# Altium schematic sheet can.SchDoc: {Наименование}
size 209 x 297 mm; DocumentNumber: {Обозначение}; SheetNumber: 3; SheetTotal: 4; PageSetup: Record=PageOptions|CenterHorizontal=False|CenterVertical=False|PrintScale=0.95|XCorrection=0.00|YCorrection=0.00|PrintKind=1|BorderSize=5000000|LeftOffset=0|BottomOffset=0|Orientation=1|PaperLength=1000|PaperWidth=1000|Scale=100|PaperSource=15|PrintQuality=600|MediaType=1|DitherType=10|PaperKind=A4|PrintScaleMode=1; Rule: PcbType=ProtelPcb
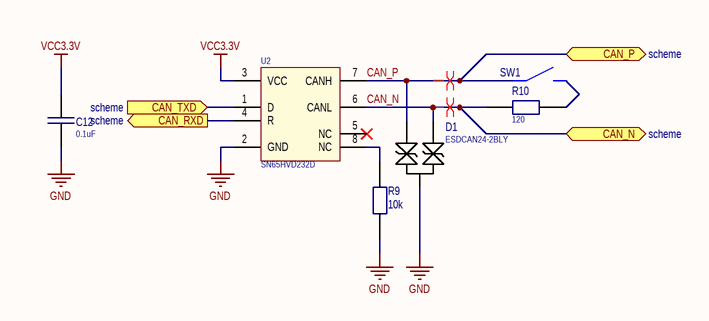
[diagram p0: can.SchDoc]

## Parts
C12  0.1uF  [C_0603]
D1  ESDCAN24-2BLY  [SOT23]
R9  10k  [R_0603]
R10  120  [R_0603]
SW1  DS1040-01RT  [DS1040-01RT]  (value not drawn)
U2  SN65HVD232D  [SO-8_M]

## Ports
CAN_N (bidir, see scheme), CAN_P (bidir, see scheme), CAN_RXD (out, see scheme), CAN_TXD (in, see scheme)

## Nets
GND: C12.1 D1.3 R9.2 U2.2(GND)
VCC3.3V: C12.2 U2.3(VCC)
CAN_N: D1.2 R10.2 U2.6(CANL) ; port CAN_N
CAN_P: D1.1 SW1.1 U2.7(CANH) ; port CAN_P
CAN_RXD: U2.4(R) ; port CAN_RXD
CAN_TXD: U2.1(D) ; port CAN_TXD
NetR9_1: R9.1 U2.8(NC)
NetR10_1: R10.1 SW1.2

Not connected (* = marked no-connect by the designer): U2 5(NC)*

## Layout directives
differential pair: CAN_N, CAN_P

## Notes on the sheet
- Подп. и дата
- Инв. № дубл.
- Взам. инв. №
- Инв. № подл.
- Лист
- Изм.
- № докум.
- Подп.
- Дата

## Library data of the parts
C12 = CAP_SMD: Capacitor; Part Number: CC0603KPX7R9BB104; Alternative Part: *; Value: 0.1uF
D1 = ESD_CAN: ESD; Value: ESDCAN24-2BLY; Part Number: ESDCAN24-2BLY; Alternative Part: *
R9 = RES_SMD: Resistor; Part Number: RC0603FR-0710KL; Alternative Part: *; Value: 10k
R10 = RES_SMD: Resistor; Part Number: RC0603FR-07120RL; Alternative Part: *; Value: 120
SW1 = button_dip
U2 = SN65HVD232D: CAN_transiever; Part Number: SN65HVD232D